# Altium schematic sheet FMC_Delay_1ns_4Cha.SchDoc: Fine delay FMC
size 420 x 297 mm; CheckedBy: -; CompanyName: CERN; DrawnBy: GK; Organization: CERN; Address1: European Organization for Nuclear Research; Address2: CH-1211 Geneve 23 - Switzerland; Revision: -; SheetNumber: 1; SheetTotal: 9; EDA_Number: EDA-02667-V2-0; Projet: FMC Delay 1ns 4cha; ModifiedBy: -; CheckedDate: -; Title2: top level diagram; DivGrp: BE-CO; Designer: GK; ModifiedDate: -; ProjectName: FMC Delay 1ns 4cha
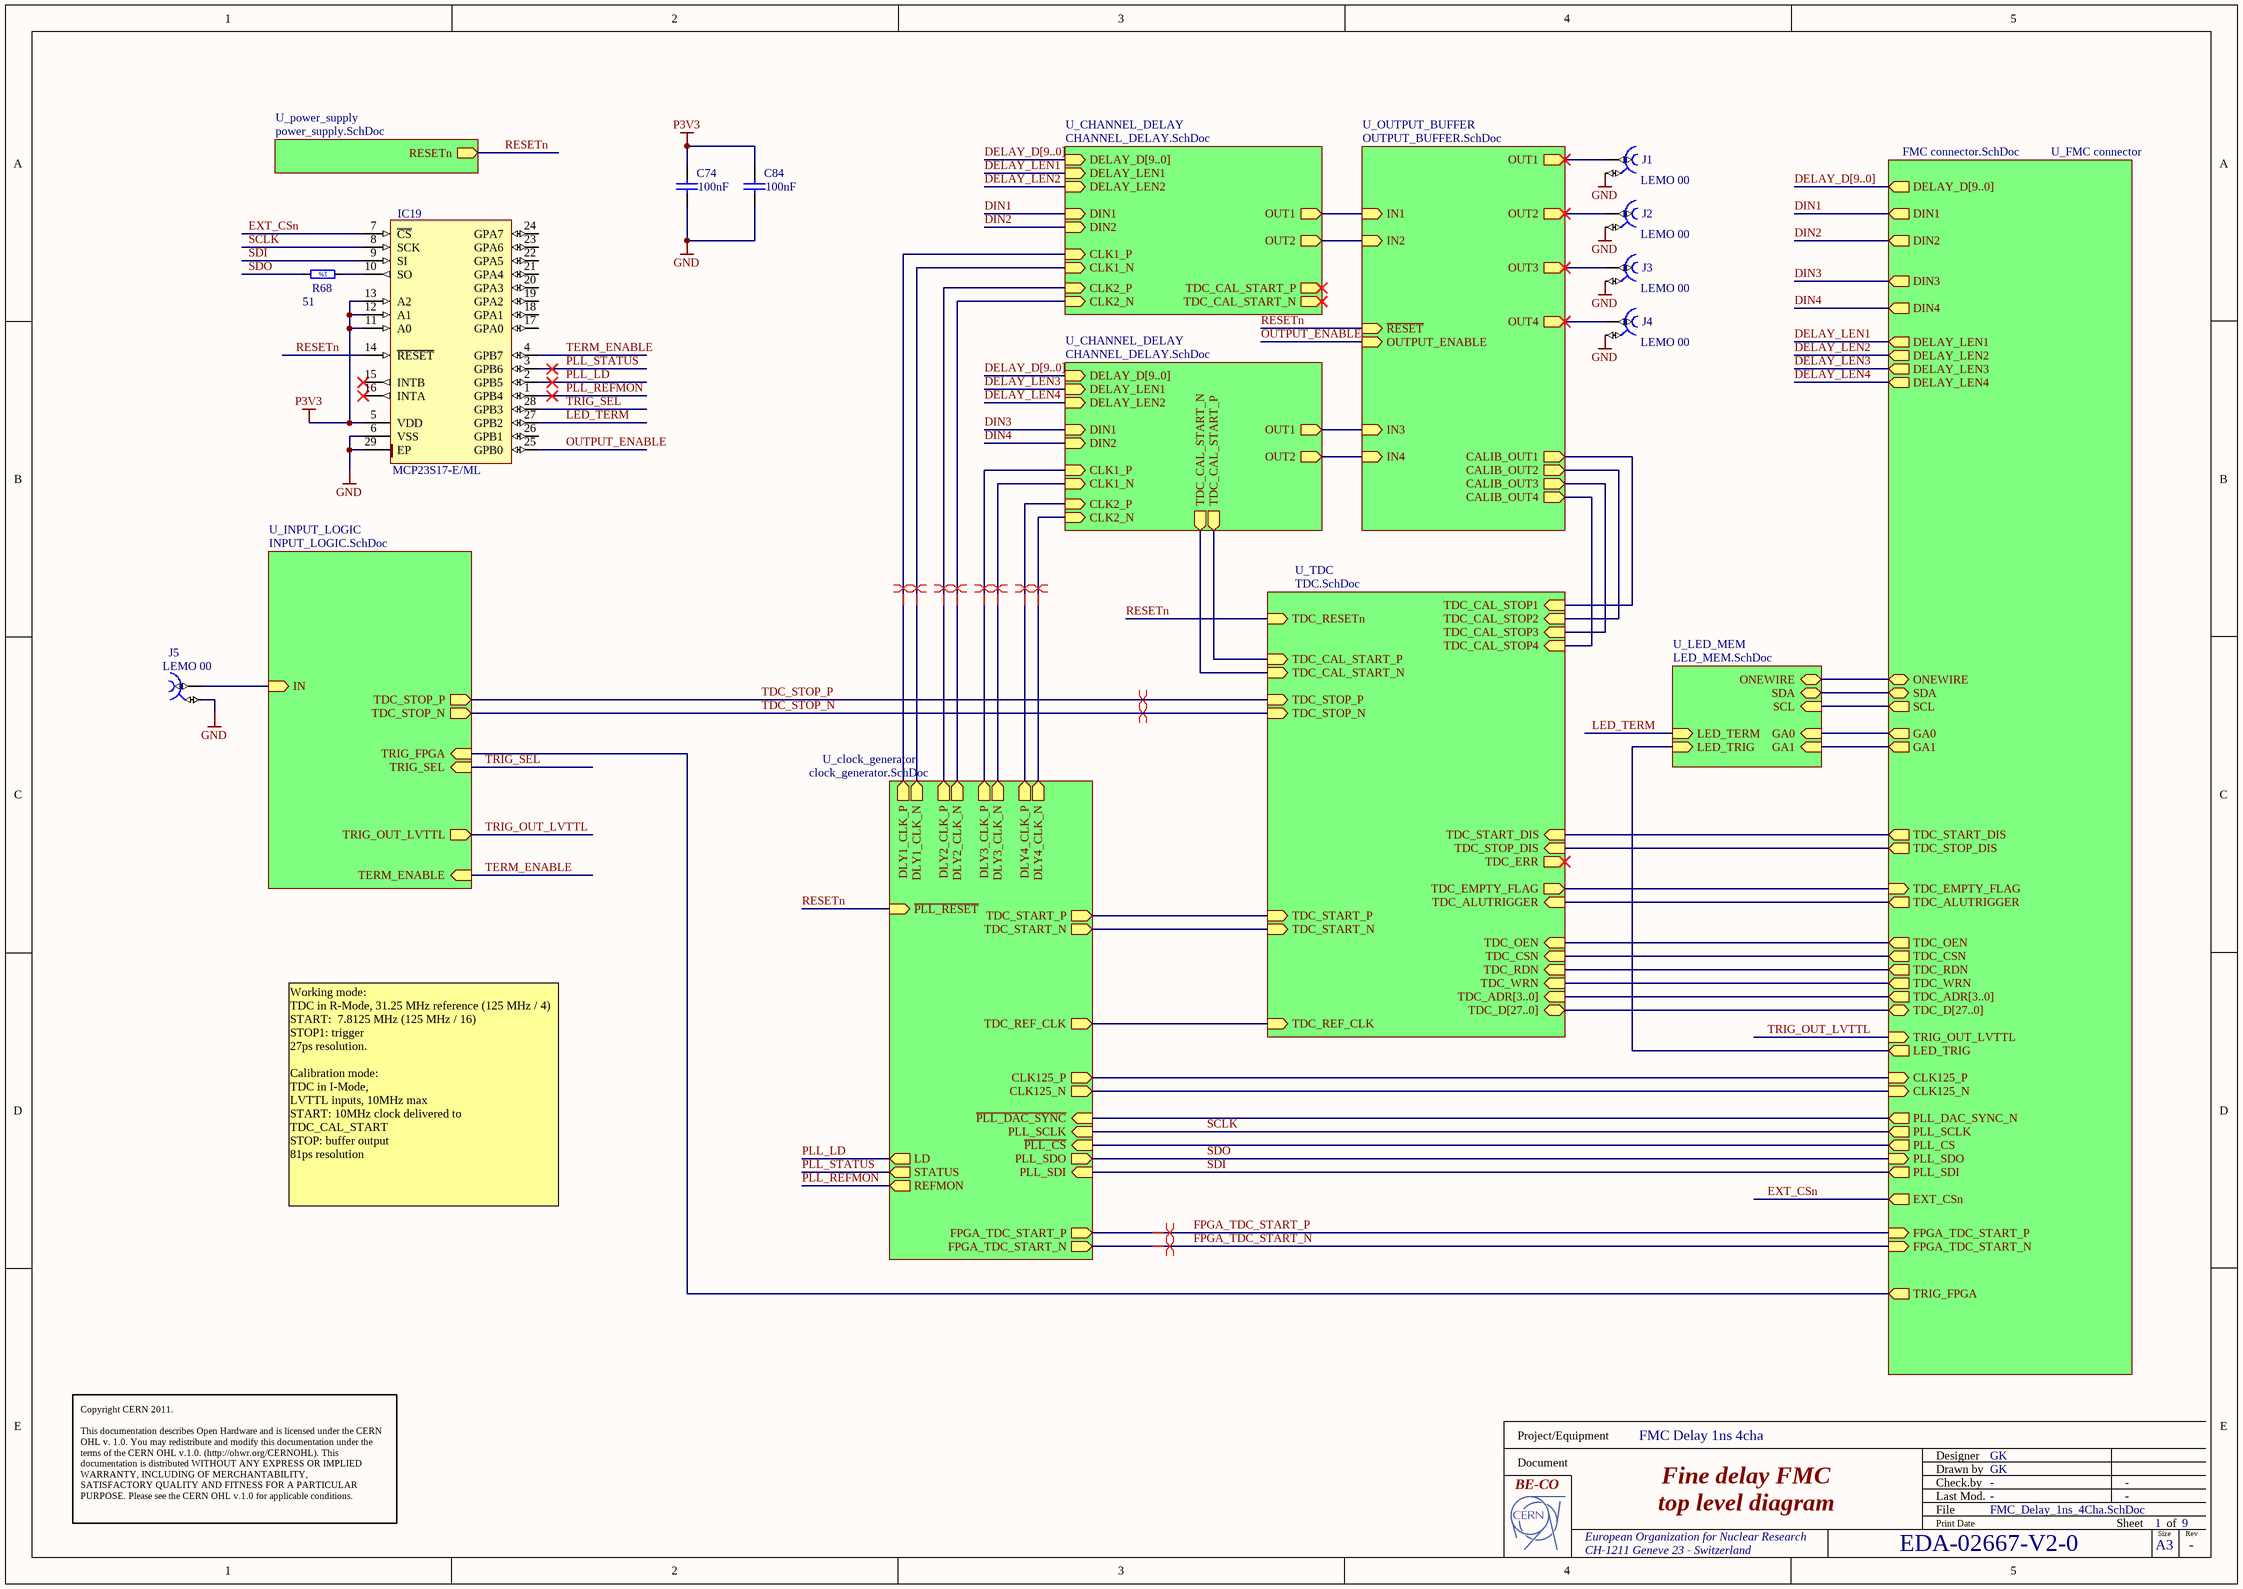
[diagram p0: FMC_Delay_1ns_4Cha.SchDoc]

## Parts
C74  100nF  [CAPC1608X87N]
C84  100nF  [CAPC1608X87N]
IC19  MCP23S17-E/ML  [QFN65P600X600X100-29N-S420]
J1  LEMO 00  [LEMO_EPL.00.250.NTN]
J2  LEMO 00  [LEMO_EPL.00.250.NTN]
J3  LEMO 00  [LEMO_EPL.00.250.NTN]
J4  LEMO 00  [LEMO_EPL.00.250.NTN]
J5  LEMO 00  [LEMO_EPL.00.250.NTN]
R68  51  [RESC1608X55N]

## Sub-sheets
U_CHANNEL_DELAY = CHANNEL_DELAY.SchDoc: DELAY_D[9..0] (in), DELAY_LEN1 (in), DELAY_LEN2 (in), DIN1 (in), DIN2 (in), OUT1 (out), OUT2 (out), TDC_CAL_START_P (out), TDC_CAL_START_N (out), CLK1_P (in), CLK1_N (in), CLK2_N (in), CLK2_P (in)
U_CHANNEL_DELAY = CHANNEL_DELAY.SchDoc: DELAY_D[9..0] (in), DELAY_LEN1 (in), DELAY_LEN2 (in), DIN1 (in), DIN2 (in), OUT1 (out), OUT2 (out), TDC_CAL_START_P (out), TDC_CAL_START_N (out), CLK1_P (in), CLK1_N (in), CLK2_N (in), CLK2_P (in)
U_clock_generator = clock_generator.SchDoc: PLL_SCLK (in), PLL_SDO (out), PLL_SDI (in), TDC_REF_CLK (out), CLK125_N (out), CLK125_P (out), LD (out), STATUS (out), REFMON (out), DLY1_CLK_P (out), DLY1_CLK_N (out), DLY2_CLK_P (out), DLY2_CLK_N (out), DLY3_CLK_P (out), DLY3_CLK_N (out), DLY4_CLK_P (out), DLY4_CLK_N (out), ~{PLL_CS} (in), ~{PLL_RESET} (in), ~{PLL_DAC_SYNC} (in), TDC_START_P (out), TDC_START_N (out), FPGA_TDC_START_N (out), FPGA_TDC_START_P (out)
U_FMC connector = FMC connector.SchDoc: DIN1 (out), DIN2 (out), DIN3 (out), DIN4 (out), TDC_START_DIS (out), TDC_STOP_DIS (out), TDC_EMPTY_FLAG (in), TDC_CSN (out), TDC_RDN (out), TDC_WRN (out), TDC_ADR[3..0] (out), TDC_D[27..0] (bidir), DELAY_LEN1 (out), DELAY_LEN2 (out), DELAY_LEN3 (out), DELAY_LEN4 (out), PLL_SCLK (out), PLL_CS (out), PLL_SDO (in), PLL_SDI (out), CLK125_P (in), CLK125_N (in), TRIG_OUT_LVTTL (in), DELAY_D[9..0] (out), TRIG_FPGA (out), SDA (bidir), SCL (out), GA0 (out), GA1 (out), EXT_CSn (out), PLL_DAC_SYNC_N (out), TDC_OEN (out), TDC_ALUTRIGGER (out), FPGA_TDC_START_N (in), FPGA_TDC_START_P (in), ONEWIRE (bidir), LED_TRIG (out)
U_INPUT_LOGIC = INPUT_LOGIC.SchDoc: IN (in), TERM_ENABLE (in), TRIG_OUT_LVTTL (out), TRIG_FPGA (in), TRIG_SEL (in), TDC_STOP_P (out), TDC_STOP_N (out)
U_LED_MEM = LED_MEM.SchDoc: SDA (bidir), SCL (in), GA0 (in), GA1 (in), ONEWIRE (bidir), LED_TERM (in), LED_TRIG (in)
U_OUTPUT_BUFFER = OUTPUT_BUFFER.SchDoc: IN1 (in), IN2 (in), IN3 (in), IN4 (in), OUT1 (out), OUT2 (out), OUT3 (out), OUT4 (out), ~{RESET} (in), CALIB_OUT1 (out), CALIB_OUT2 (out), CALIB_OUT3 (out), CALIB_OUT4 (out), OUTPUT_ENABLE (in)
U_power_supply = power_supply.SchDoc: RESETn (out)
U_TDC = TDC.SchDoc: TDC_ADR[3..0] (in), TDC_START_P (in), TDC_START_N (in), TDC_CAL_STOP1 (in), TDC_CAL_STOP2 (in), TDC_CAL_STOP3 (in), TDC_CAL_STOP4 (in), TDC_START_DIS (in), TDC_STOP_DIS (in), TDC_EMPTY_FLAG (out), TDC_REF_CLK (in), TDC_RESETn (in), TDC_D[27..0] (bidir), TDC_OEN (in), TDC_CSN (in), TDC_RDN (in), TDC_WRN (in), TDC_CAL_START_N (in), TDC_CAL_START_P (in), TDC_ERR (out), TDC_STOP_P (in), TDC_STOP_N (in), TDC_ALUTRIGGER (in)

## Nets
GND: C74.2 C84.2 IC19.6(VSS) IC19.29(EP) J1.2 J2.2 J3.2 J4.2 J5.2
P3V3: C74.1 C84.1 IC19.5(VDD) IC19.11(A0) IC19.12(A1) IC19.13(A2)
DELAY_LEN1: sheet U_FMC connector/DELAY_LEN1, sheet U_CHANNEL_DELAY/DELAY_LEN1
DELAY_LEN2: sheet U_FMC connector/DELAY_LEN2, sheet U_CHANNEL_DELAY/DELAY_LEN2
DELAY_LEN3: sheet U_FMC connector/DELAY_LEN3, sheet U_CHANNEL_DELAY/DELAY_LEN1
DELAY_LEN4: sheet U_FMC connector/DELAY_LEN4, sheet U_CHANNEL_DELAY/DELAY_LEN2
DIN1: sheet U_FMC connector/DIN1, sheet U_CHANNEL_DELAY/DIN1
DIN2: sheet U_FMC connector/DIN2, sheet U_CHANNEL_DELAY/DIN2
DIN3: sheet U_FMC connector/DIN3, sheet U_CHANNEL_DELAY/DIN1
DIN4: sheet U_FMC connector/DIN4, sheet U_CHANNEL_DELAY/DIN2
EXT_CSn: IC19.7(~{CS}) ; sheet U_FMC connector/EXT_CSn
FPGA_TDC_START_N: sheet U_clock_generator/FPGA_TDC_START_N, sheet U_FMC connector/FPGA_TDC_START_N
FPGA_TDC_START_P: sheet U_clock_generator/FPGA_TDC_START_P, sheet U_FMC connector/FPGA_TDC_START_P
LED_TERM: IC19.27(GPB2) ; sheet U_LED_MEM/LED_TERM
OUTPUT_ENABLE: IC19.25(GPB0) ; sheet U_OUTPUT_BUFFER/OUTPUT_ENABLE
PLL_LD: IC19.2(GPB5) ; sheet U_clock_generator/LD
PLL_REFMON: IC19.1(GPB4) ; sheet U_clock_generator/REFMON
PLL_STATUS: IC19.3(GPB6) ; sheet U_clock_generator/STATUS
RESETn: IC19.14(~{RESET}) ; sheet U_clock_generator/~{PLL_RESET}, sheet U_power_supply/RESETn, sheet U_TDC/TDC_RESETn, sheet U_OUTPUT_BUFFER/~{RESET}
SCLK: IC19.8(SCK) ; sheet U_clock_generator/PLL_SCLK, sheet U_FMC connector/PLL_SCLK
SDI: IC19.9(SI) ; sheet U_clock_generator/PLL_SDI, sheet U_FMC connector/PLL_SDI
SDO: R68.2 ; sheet U_clock_generator/PLL_SDO, sheet U_FMC connector/PLL_SDO
TDC_STOP_N: sheet U_TDC/TDC_STOP_N, sheet U_INPUT_LOGIC/TDC_STOP_N
TDC_STOP_P: sheet U_TDC/TDC_STOP_P, sheet U_INPUT_LOGIC/TDC_STOP_P
TERM_ENABLE: IC19.4(GPB7) ; sheet U_INPUT_LOGIC/TERM_ENABLE
TRIG_OUT_LVTTL: sheet U_FMC connector/TRIG_OUT_LVTTL, sheet U_INPUT_LOGIC/TRIG_OUT_LVTTL
TRIG_SEL: IC19.28(GPB3) ; sheet U_INPUT_LOGIC/TRIG_SEL
NetIC19_10: IC19.10(SO) R68.1
NetJ1_1: J1.1 ; sheet U_OUTPUT_BUFFER/OUT1
NetJ2_1: J2.1 ; sheet U_OUTPUT_BUFFER/OUT2
NetJ3_1: J3.1 ; sheet U_OUTPUT_BUFFER/OUT3
NetJ4_1: J4.1 ; sheet U_OUTPUT_BUFFER/OUT4
NetJ5_1: J5.1 ; sheet U_INPUT_LOGIC/IN
(unnamed): sheet U_clock_generator/TDC_REF_CLK, sheet U_TDC/TDC_REF_CLK
(unnamed): sheet U_clock_generator/CLK125_N, sheet U_FMC connector/CLK125_N
(unnamed): sheet U_clock_generator/CLK125_P, sheet U_FMC connector/CLK125_P
(unnamed): sheet U_clock_generator/DLY1_CLK_P, sheet U_CHANNEL_DELAY/CLK1_P
(unnamed): sheet U_clock_generator/DLY1_CLK_N, sheet U_CHANNEL_DELAY/CLK1_N
(unnamed): sheet U_clock_generator/DLY2_CLK_P, sheet U_CHANNEL_DELAY/CLK2_P
(unnamed): sheet U_clock_generator/DLY2_CLK_N, sheet U_CHANNEL_DELAY/CLK2_N
(unnamed): sheet U_clock_generator/DLY3_CLK_P, sheet U_CHANNEL_DELAY/CLK1_P
(unnamed): sheet U_clock_generator/DLY3_CLK_N, sheet U_CHANNEL_DELAY/CLK1_N
(unnamed): sheet U_clock_generator/DLY4_CLK_P, sheet U_CHANNEL_DELAY/CLK2_P
(unnamed): sheet U_clock_generator/DLY4_CLK_N, sheet U_CHANNEL_DELAY/CLK2_N
(unnamed): sheet U_clock_generator/~{PLL_CS}, sheet U_FMC connector/PLL_CS
(unnamed): sheet U_clock_generator/~{PLL_DAC_SYNC}, sheet U_FMC connector/PLL_DAC_SYNC_N
(unnamed): sheet U_clock_generator/TDC_START_P, sheet U_TDC/TDC_START_P
(unnamed): sheet U_clock_generator/TDC_START_N, sheet U_TDC/TDC_START_N
(unnamed): sheet U_FMC connector/TDC_START_DIS, sheet U_TDC/TDC_START_DIS
(unnamed): sheet U_FMC connector/TDC_STOP_DIS, sheet U_TDC/TDC_STOP_DIS
(unnamed): sheet U_FMC connector/TDC_EMPTY_FLAG, sheet U_TDC/TDC_EMPTY_FLAG
(unnamed): sheet U_FMC connector/TDC_CSN, sheet U_TDC/TDC_CSN
(unnamed): sheet U_FMC connector/TDC_RDN, sheet U_TDC/TDC_RDN
(unnamed): sheet U_FMC connector/TDC_WRN, sheet U_TDC/TDC_WRN
(unnamed): sheet U_FMC connector/TRIG_FPGA, sheet U_INPUT_LOGIC/TRIG_FPGA
(unnamed): sheet U_FMC connector/SDA, sheet U_LED_MEM/SDA
(unnamed): sheet U_FMC connector/SCL, sheet U_LED_MEM/SCL
(unnamed): sheet U_FMC connector/GA0, sheet U_LED_MEM/GA0
(unnamed): sheet U_FMC connector/GA1, sheet U_LED_MEM/GA1
(unnamed): sheet U_FMC connector/TDC_OEN, sheet U_TDC/TDC_OEN
(unnamed): sheet U_FMC connector/TDC_ALUTRIGGER, sheet U_TDC/TDC_ALUTRIGGER
(unnamed): sheet U_FMC connector/ONEWIRE, sheet U_LED_MEM/ONEWIRE
(unnamed): sheet U_FMC connector/LED_TRIG, sheet U_LED_MEM/LED_TRIG
(unnamed): sheet U_TDC/TDC_CAL_STOP1, sheet U_OUTPUT_BUFFER/CALIB_OUT1
(unnamed): sheet U_TDC/TDC_CAL_STOP2, sheet U_OUTPUT_BUFFER/CALIB_OUT2
(unnamed): sheet U_TDC/TDC_CAL_STOP3, sheet U_OUTPUT_BUFFER/CALIB_OUT3
(unnamed): sheet U_TDC/TDC_CAL_STOP4, sheet U_OUTPUT_BUFFER/CALIB_OUT4
(unnamed): sheet U_TDC/TDC_CAL_START_N, sheet U_CHANNEL_DELAY/TDC_CAL_START_N
(unnamed): sheet U_TDC/TDC_CAL_START_P, sheet U_CHANNEL_DELAY/TDC_CAL_START_P
(unnamed): sheet U_CHANNEL_DELAY/OUT1, sheet U_OUTPUT_BUFFER/IN1
(unnamed): sheet U_CHANNEL_DELAY/OUT2, sheet U_OUTPUT_BUFFER/IN2
(unnamed): sheet U_CHANNEL_DELAY/OUT1, sheet U_OUTPUT_BUFFER/IN3
(unnamed): sheet U_CHANNEL_DELAY/OUT2, sheet U_OUTPUT_BUFFER/IN4

Not connected (* = marked no-connect by the designer): IC19 15(INTB)* 16(INTA)* 17(GPA0) 18(GPA1) 19(GPA2) 20(GPA3) 21(GPA4) 22(GPA5) 23(GPA6) 24(GPA7) 26(GPB1)

## Buses and harness runs
bus DELAY_D[9..0] = sheet U_CHANNEL_DELAY/DELAY_D[9..0]
bus DELAY_D[9..0] = sheet U_FMC connector/DELAY_D[9..0]
bus sheet U_FMC connector/TDC_ADR[3..0] = sheet U_TDC/TDC_ADR[3..0]
bus sheet U_FMC connector/TDC_D[27..0] = sheet U_TDC/TDC_D[27..0]

## Layout directives
differential pair: (no net found under the mark), FPGA_TDC_START_N, FPGA_TDC_START_P, TDC_STOP_N, TDC_STOP_P

## Notes on the sheet
- Working mode:
  TDC in R-Mode, 31.25 MHz reference (125 MHz / 4)
  START:  7.8125 MHz (125 MHz / 16)
  STOP1: trigger
  27ps resolution.
  Calibration mode:
  TDC in I-Mode,
  LVTTL inputs, 10MHz max
  START: 10MHz clock delivered to TDC_CAL_START
  STOP: buffer output
  81ps resolution
- Copyright CERN 2011.
  This documentation describes Open Hardware and is licensed under the CERN OHL v. 1.0. You may redistribute and modify this documentation under the terms of the CERN OHL v.1.0. (http://ohwr.org/CERNOHL). This documentation is distributed WITHOUT ANY EXPRESS OR IMPLIED WARRANTY, INCLUDING OF MERCHANTABILITY, SATISFACTORY QUALITY AND FITNESS FOR A PARTICULAR PURPOSE. Please see the CERN OHL v.1.0 for applicable conditions.
- Project/Equipment
- Document
- Designer
- Drawn by
- Check.by
- File
- Last Mod.
- Print Date
- Sheet
- Size
- A3
- of
- Rev
- (in symbol R0603_51R_1%_0.1W_100PPM) 1%

## Library data of the parts
C74 C84 = CC0603_100NF_50V_10%_X7R: Non-polarised capacitor; Manufacturer1 Part Number: 223858615649; Manufacturer: GENERIC; Part Description: SMD Multilayer Chip Ceramic Capacitor; Table: Capacitors SMD; TC: X7R; Tolerance: ±10%; Voltage: 50V; Author: CERN DEM JLC; Case: 0603; Component Type: Standard; CreateDate: 12/3/2007; HelpURL: \\cern.ch\dfs\Applications\Altium\Datasheets\CC0603_X7R_PHYCOMP.pdf; LatestRevisionDate: 12/3/2007; Manufacturer1 ComponentHeight: 0.87mm; Manufacturer1 Example: PHYCOMP; Manufacturer Part Number: CC0603_100NF_50V_10%_X7R; Mounted: Yes; Pin Count: 2; SMD: Yes; Socket: No; Status: Preferred; Value: 100nF; Part Number: CC0603_100NF_50V_10%_X7R; Component Kind: Standard
IC19 = MCP23S17-E/ML: 16-bit I/O Port Expander With Serial Interface; Manufacturer: MICROCHIP TECHNOLOGY; Table: Analog & Interface; Part Number: MCP23S17-E/ML; Component Kind: Standard; Component Type: Standard; Device: MCP23S17-E/ML; PackageDescription: QFN, 0.65mm pitch, square; 28 pin, 6.00mm L X 6.00mm W X 1.00mm H body (w/thermal tab 4.2mm x 4.2mm), IPC Medium Density; Part Description: 16-bit I/O Port Expander With Serial Interface; Manufacturer Part Number: MCP23S17-E/ML; Pin Count: 29; Case: QFN28; Mounted: Yes; Socket: No; SMD: Yes; ComponentHeight: 1mm; Author: CERN DEM JLC; HelpURL: \\cern.ch\dfs\Applications\Altium\Datasheets\MCP23S17-E-ML.pdf; CreateDate: 5/11/2010; LatestRevisionDate: 5/11/2010
J1-J5 = LEMO_EPL.00.250.NTN: Part Description: Size 00, 50 Ohms Coaxial Elbow (90°) socket; SCEM: 09.46.11.180.6; Part Number: LEMO_EPL.00.250.NTN; Component Kind: Standard; Component Type: Standard; Pin Count: 2; Family: LEMO 00; Mounted: Yes; Socket: No; SMD: No; Status: None; Manufacturer: LEMO; Manufacturer Part Number: EPL.00.250.NTN; ComponentHeight: 7mm; HelpURL: \\cern.ch\dfs\Applications\Altium\Datasheets\LEMO_EPL.00.250.NTN.pdf; Author: CERN DEM JLC; CreateDate: 12/3/2007; LatestRevisionDate: 3/13/2008; Table: LEMO
R68 = R0603_51R_1%_0.1W_100PPM: Resistor - 1%; Part Description: General Purpose Thick Film Chip Resistor; Manufacturer: GENERIC; Manufacturer1 Part Number: NRC06F51R0TRF; Power: 0.1W; TC: ±100ppm/°C; Table: Resistors SMD; Part Number: R0603_51R_1%_0.1W_100PPM; Component Kind: Standard; Component Type: Standard; Pin Count: 2; Value: 51; Status: Preferred; Tolerance: ±1%; Manufacturer Part Number: R0603_51R_1%_0.1W_100PPM; Case: 0603; Mounted: Yes; Socket: No; SMD: Yes; Manufacturer1 Example: NIC COMPONENT; Manufacturer1 ComponentHeight: 0.55mm; HelpURL: \\cern.ch\dfs\Applications\Altium\Datasheets\R0603_NIC_NRC.pdf; Author: CERN DEM JLC; CreateDate: 12/3/2007; LatestRevisionDate: 3/13/2008